# EAGLE design PDSP-py-2 (EAGLE 7.3.0)
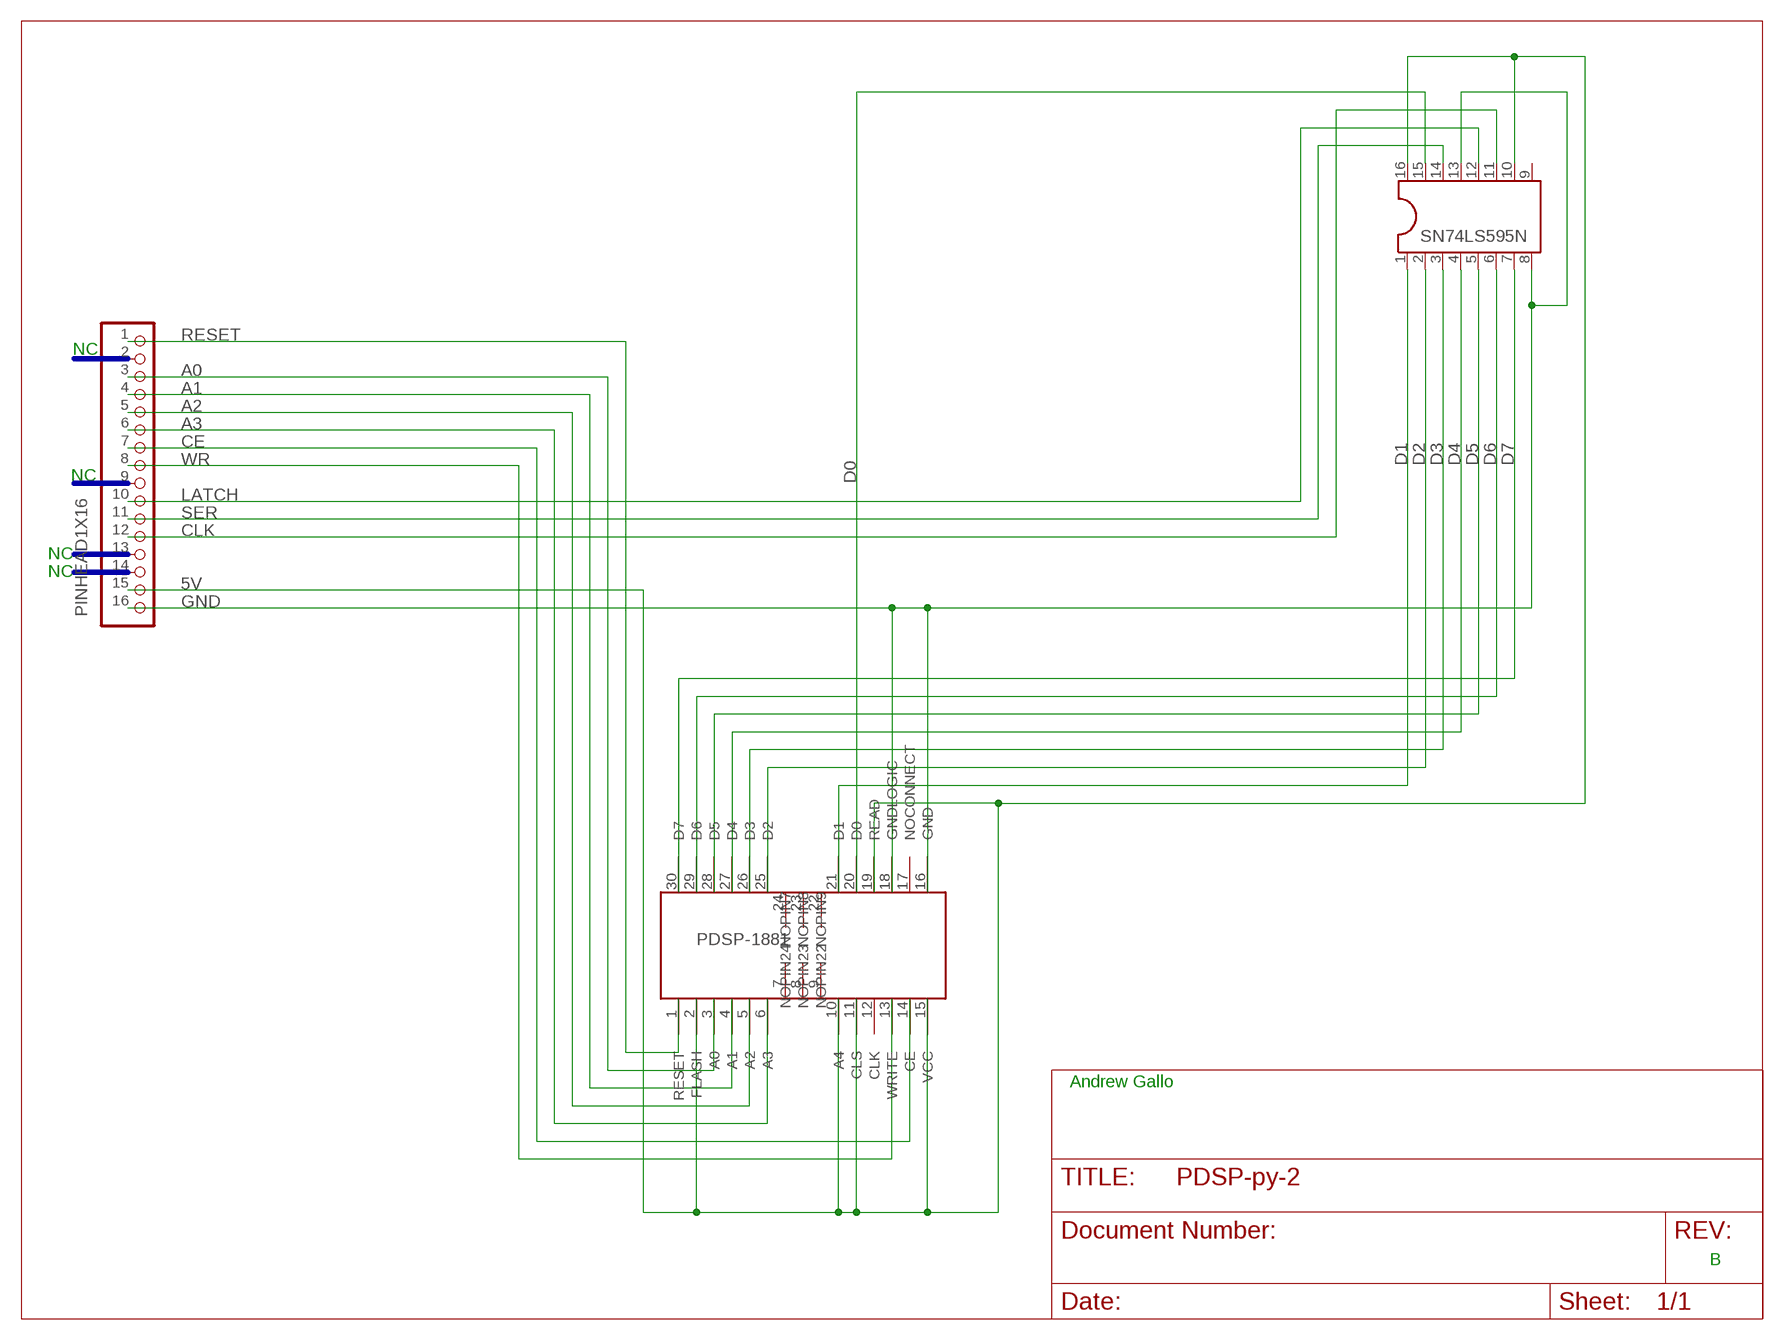
[diagram p0: schematic, sheet 1]

## Parts
PDSP-1881  AKG-PDSP-188-DEV  [AKG-PDSP-188X-PAC]
PINHEAD1X16  PINHD-1X16  [1X16]
SN74LS595N  DIL16  [DIL16]

## Nets
5V: PDSP-1881.2(FLASH) PDSP-1881.10(A4) PDSP-1881.11(CLS) PDSP-1881.15(VCC) PDSP-1881.19(READ) PINHEAD1X16.15 SN74LS595N.10 SN74LS595N.16
A0: PDSP-1881.3(A0) PINHEAD1X16.3
A1: PDSP-1881.4(A1) PINHEAD1X16.4
A2: PDSP-1881.5(A2) PINHEAD1X16.5
A3: PDSP-1881.6(A3) PINHEAD1X16.6
CE: PDSP-1881.14(CE) PINHEAD1X16.7
CLK: PINHEAD1X16.12 SN74LS595N.11
D0: PDSP-1881.20(D0) SN74LS595N.15
D1: PDSP-1881.21(D1) SN74LS595N.1
D2: PDSP-1881.25(D2) SN74LS595N.2
D3: PDSP-1881.26(D3) SN74LS595N.3
D4: PDSP-1881.27(D4) SN74LS595N.4
D5: PDSP-1881.28(D5) SN74LS595N.5
D6: PDSP-1881.29(D6) SN74LS595N.6
D7: PDSP-1881.30(D7) SN74LS595N.7
GND: PDSP-1881.16(GND) PDSP-1881.18(GNDLOGIC) PINHEAD1X16.16 SN74LS595N.8 SN74LS595N.13
LATCH: PINHEAD1X16.10 SN74LS595N.12
RESET: PDSP-1881.1(RESET) PINHEAD1X16.1
SER: PINHEAD1X16.11 SN74LS595N.14
WR: PDSP-1881.13(WRITE) PINHEAD1X16.8
Unconnected: PDSP-1881.7(NOPIN7) PDSP-1881.8(NOPIN8) PDSP-1881.9(NOPIN9) PDSP-1881.12(CLK) PDSP-1881.17(NOCONNECT) PDSP-1881.22(NOPIN22) PDSP-1881.23(NOPIN23) PDSP-1881.24(NOPIN24) PINHEAD1X16.2 PINHEAD1X16.9 PINHEAD1X16.13 PINHEAD1X16.14 SN74LS595N.9

## Buses
NC
B$1
B$2
B$3

## Notes on the sheet
- NC
- NC
- NC
- NC
- Andrew Gallo
- B

## Library data of the parts
PDSP-1881 = akg:AKG-PDSP-188*-DEV: PDSP-188x The PDSP1880 (Red), PDSP1881 (Yellow), PDSP1882 (High Efficiency Red), PDSP1883 (Green), and PDSP1884 (High Efficiency Green) are eight digit, 5x7 dot matrix, alphanumeric Programmable Displays. The 0.180 inch high digits are packaged in a rugged, high quality, optically transpar- ent, 0.300 inch lead spacing, 30 pin plastic DIP.
PINHEAD1X16 = pinhead:PINHD-1X16: PIN HEADER
SN74LS595N = ic-package:DIL16: Dual In Line / Socket

## Board
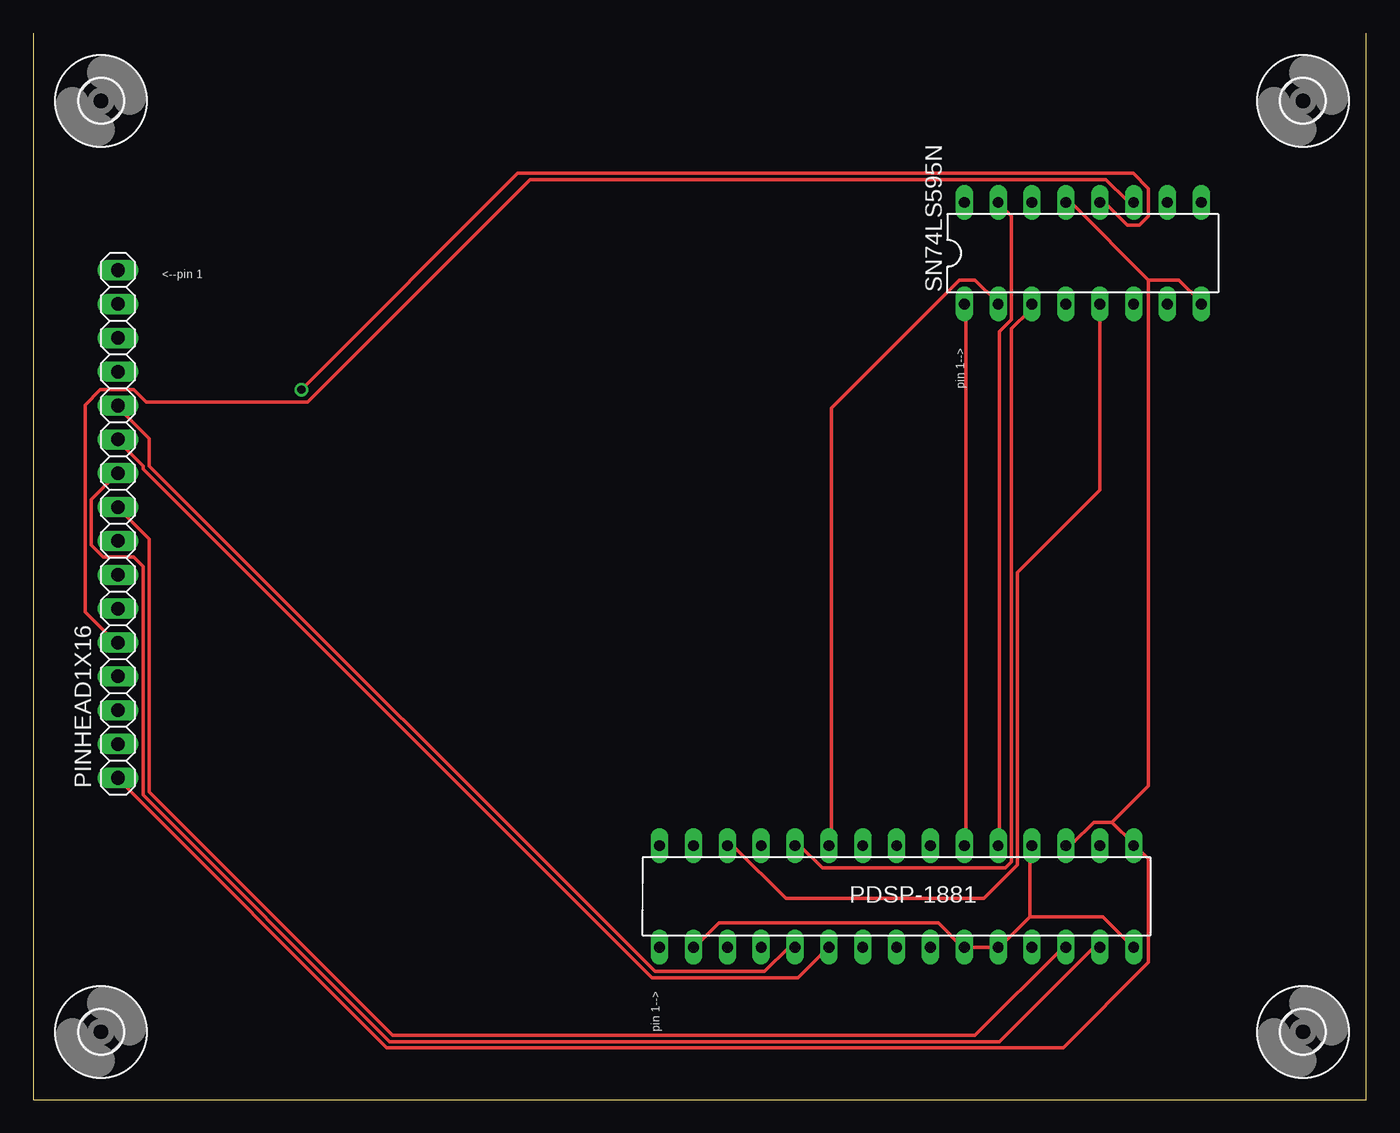
[diagram p1: board, top side]
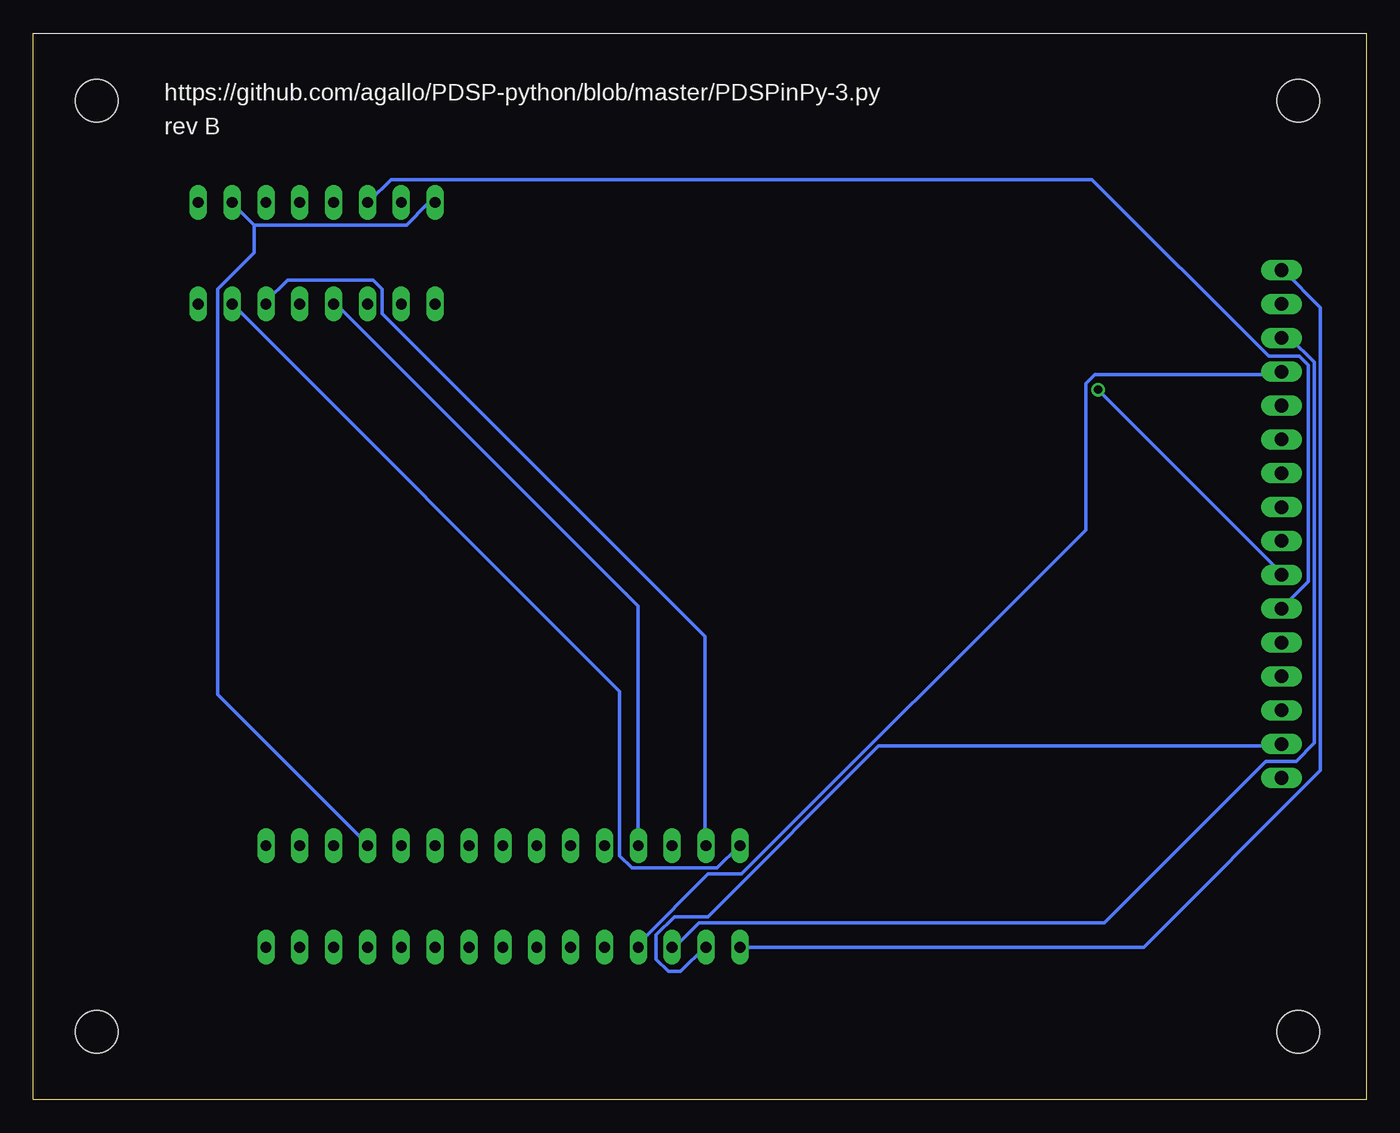
[diagram p2: board, bottom side, seen from below]

Size 100 x 80 mm. Coordinates in mm from the lower left corner, seen from the top.
Outline: 100,80 100,0 0,0 0,80
Copper layers (1*16): Top 0.035mm / dielectric 1.5mm / Bottom 0.035mm
Design rules "default": minimum track width 10mil, minimum drill 24mil, track to track 8mil, track to pad 8mil, pad to pad 8mil, via to via 8mil, smd to smd 8mil, copper to edge 40mil, drill to drill 8mil, minimum pad ring 10mil, minimum via ring 8mil, stop-mask expansion 4mil, vias tented up to drill 0mil, thermal gap 10mil

### Footprints (pad centres in the part's own frame; a part is rotated, then mirrored left to right if it is on the bottom)
AKG-PDSP-188X-PAC = drill 0.813 long: 1 -16.51,-3.81; 2 -13.97,-3.81; 3 -11.43,-3.81; 4 -8.89,-3.81; 5 -6.35,-3.81; 6 -3.81,-3.81; 7 -1.27,-3.81; 8 1.27,-3.81; 9 3.81,-3.81; 10 6.35,-3.81; 11 8.89,-3.81; 12 11.43,-3.81; 13 13.97,-3.81; 14 16.51,-3.81; 15 19.05,-3.81; 16 19.05,3.81; 17 16.51,3.81; 18 13.97,3.81; 19 11.43,3.81; 20 8.89,3.81; 21 6.35,3.81; 22 3.81,3.81; 23 1.27,3.81; 24 -1.27,3.81; 25 -3.81,3.81; 26 -6.35,3.81; 27 -8.89,3.81; 28 -11.43,3.81; 29 -13.97,3.81; 30 -16.51,3.81
1X16 = drill 1.016 long: 1 -19.05,0; 2 -16.51,0; 3 -13.97,0; 4 -11.43,0; 5 -8.89,0; 6 -6.35,0; 7 -3.81,0; 8 -1.27,0; 9 1.27,0; 10 3.81,0; 11 6.35,0; 12 8.89,0; 13 11.43,0; 14 13.97,0; 15 16.51,0; 16 19.05,0
DIL16 = drill 0.813 long: 1 -8.89,-3.81; 2 -6.35,-3.81; 3 -3.81,-3.81; 4 -1.27,-3.81; 5 1.27,-3.81; 6 3.81,-3.81; 7 6.35,-3.81; 8 8.89,-3.81; 9 8.89,3.81; 10 6.35,3.81; 11 3.81,3.81; 12 1.27,3.81; 13 -1.27,3.81; 14 -3.81,3.81; 15 -6.35,3.81; 16 -8.89,3.81
3,2 = hole 3.2: 0,0

### Placement (x,y rotation side)
PDSP-1881  63.5,15.24 0 top
PINHEAD1X16  6.35,43.18 270 top
SN74LS595N  78.74,63.5 0 top
U$1  [3,2]  5.08,74.93 0 top
U$2  [3,2]  95.25,74.93 0 top
U$3  [3,2]  95.25,5.08 0 top
U$4  [3,2]  5.08,5.08 0 top

### Tracks (layer width: path | path; a pad name or v marks a point on that pad's centre or on a via)
5V
  Top 0.254: PDSP-1881.2 49.61,11.43 51.44,13.26 67.89,13.26 69.72,11.43 PDSP-1881.10 PDSP-1881.11 72.47,11.43 74.75,13.72 | 74.75,13.72 74.75,18.97 PDSP-1881.19 | 74.75,13.72 80.24,13.72 82.53,11.43 PDSP-1881.15
  Bottom 0.254: 83.44,65.61 72.01,65.61 70.41,67.21 69.95,67.21 SN74LS595N.16 | 83.44,65.61 85.04,67.21 SN74LS595N.10 | PINHEAD1X16.15 6.4,26.52 36.58,26.52 49.38,13.72 51.89,13.72 53.26,12.34 53.26,10.52 52.35,9.6 51.44,9.6 49.61,11.43 PDSP-1881.2 | 83.44,65.61 83.44,63.55 86.18,60.81 86.18,30.4 74.98,19.2 PDSP-1881.19
A0
  Bottom 0.254: PINHEAD1X16.3 5.71,57.15 3.89,55.32 3.89,26.75 5.26,25.38 7.54,25.38 19.66,13.26 50.06,13.26 51.89,11.43 PDSP-1881.3
A1
  Bottom 0.254: PDSP-1881.4 54.41,11.43 54.41,11.89 49.38,16.92 46.86,16.92 21.03,42.75 21.03,53.72 20.34,54.41 6.4,54.41 PINHEAD1X16.4
A2
  Top 0.254: PDSP-1881.5 56.69,11.43 54.86,9.6 46.63,9.6 8.69,47.55 8.69,49.61 6.4,51.89 PINHEAD1X16.5
A3
  Top 0.254: PDSP-1881.6 59.66,11.43 57.38,9.14 46.41,9.14 8.23,47.32 8.23,47.55 6.4,49.38 PINHEAD1X16.6
CE
  Top 0.254: PDSP-1881.14 79.55,11.43 72.47,4.34 26.75,4.34 8.23,22.86 8.23,40.01 7.54,40.69 5.26,40.69 4.34,41.6 4.34,45.03 6.17,46.86 PINHEAD1X16.7
CLK
  Top 0.254: SN74LS595N.11 82.53,67.44 82.07,67.44 80.47,69.04 37.26,69.04 20.57,52.35 8.46,52.35 7.54,53.26 5.03,53.26 3.89,52.12 3.89,36.58 6.17,34.29 PINHEAD1X16.12
D0
  Top 0.254: PDSP-1881.20 72.47,19.2 72.47,57.61 73.38,58.52 73.38,66.29 72.47,67.21 SN74LS595N.15
D1
  Top 0.254: PDSP-1881.21 69.95,19.2 69.95,59.66 SN74LS595N.1
D2
  Top 0.254: PDSP-1881.25 59.89,19.2 59.89,51.89 69.49,61.49 70.64,61.49 72.24,59.89 SN74LS595N.2
D3
  Top 0.254: PDSP-1881.26 57.15,18.97 57.61,18.97 59.21,17.37 72.92,17.37 73.38,17.83 73.38,57.84 74.75,59.21 74.75,59.66 SN74LS595N.3
D4
  Bottom 0.254: PDSP-1881.27 54.63,19.2 54.63,37.03 77.27,59.66 SN74LS595N.4
D5
  Top 0.254: SN74LS595N.5 80.01,45.72 73.84,39.55 73.84,17.6 71.32,15.09 56.46,15.09 52.58,18.97 52.12,18.97 PDSP-1881.28
D6
  Bottom 0.254: PDSP-1881.29 49.61,19.2 49.61,34.75 73.84,58.98 73.84,60.81 74.52,61.49 80.92,61.49 82.53,59.89 SN74LS595N.6
D7
  Bottom 0.254: PDSP-1881.30 47.09,18.97 48.69,17.37 55.09,17.37 56.01,18.29 56.01,30.63 85.04,59.66 SN74LS595N.7
GND
  Top 0.254: 83.67,61.49 77.95,67.21 77.5,67.21 SN74LS595N.13 | 83.67,61.49 85.95,61.49 87.55,59.89 SN74LS595N.8 | 80.92,20.8 79.55,20.8 77.95,19.2 77.5,19.2 PDSP-1881.18 | 80.92,20.8 82.53,19.2 PDSP-1881.16 82.75,18.97 83.67,18.06 83.67,10.29 77.27,3.89 26.52,3.89 6.4,24 PINHEAD1X16.16 | 83.67,61.49 83.67,23.55 80.92,20.8
LATCH  (via drill 0.61)
  Top 0.254: v20.12,53.26 36.35,69.49 82.53,69.49 83.67,68.35 83.67,66.29 82.98,65.61 82.07,65.61 80.47,67.21 80.01,67.21 SN74LS595N.12
  Bottom 0.254: v20.12,53.26 6.4,39.55 PINHEAD1X16.10
RESET
  Bottom 0.254: PDSP-1881.1 16.69,11.43 3.43,24.69 3.43,59.44 6.17,62.18 PINHEAD1X16.1
SER
  Bottom 0.254: SN74LS595N.14 74.75,67.44 73.15,69.04 20.57,69.04 7.32,55.78 5.03,55.78 4.34,55.09 4.34,38.86 6.17,37.03 PINHEAD1X16.11
WR
  Top 0.254: PDSP-1881.13 77.27,11.43 70.64,4.8 26.98,4.8 8.69,23.09 8.69,42.06 6.4,44.35 PINHEAD1X16.8

### Text on the board
tPlace: <--pin 1 | pin 1--> | pin 1-->
bPlace: https://github.com/agallo/PDSP-python/blob/master/PDSPinPy-3.py | rev B